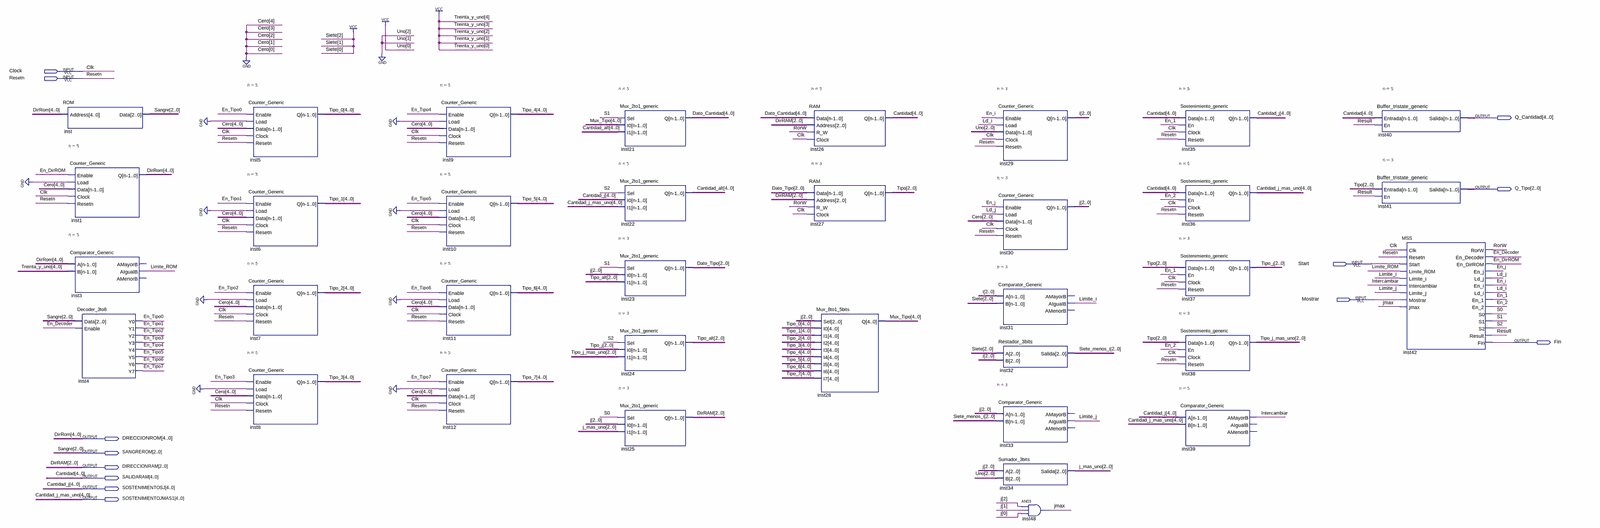
[diagram p0: schematic sheet, whole]
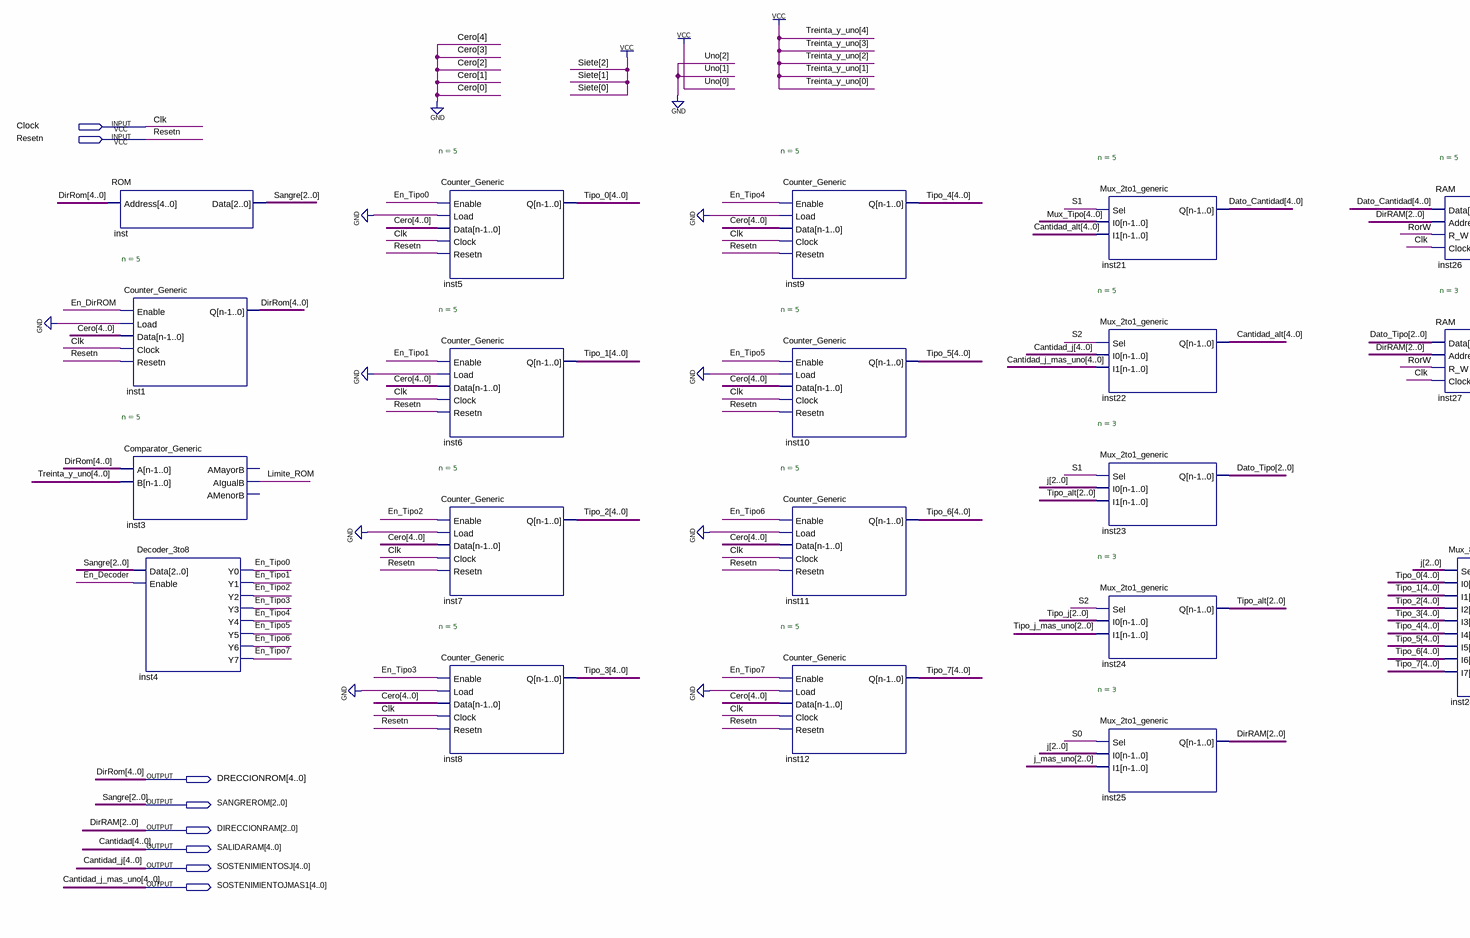
[diagram p1: schematic sheet, left part]
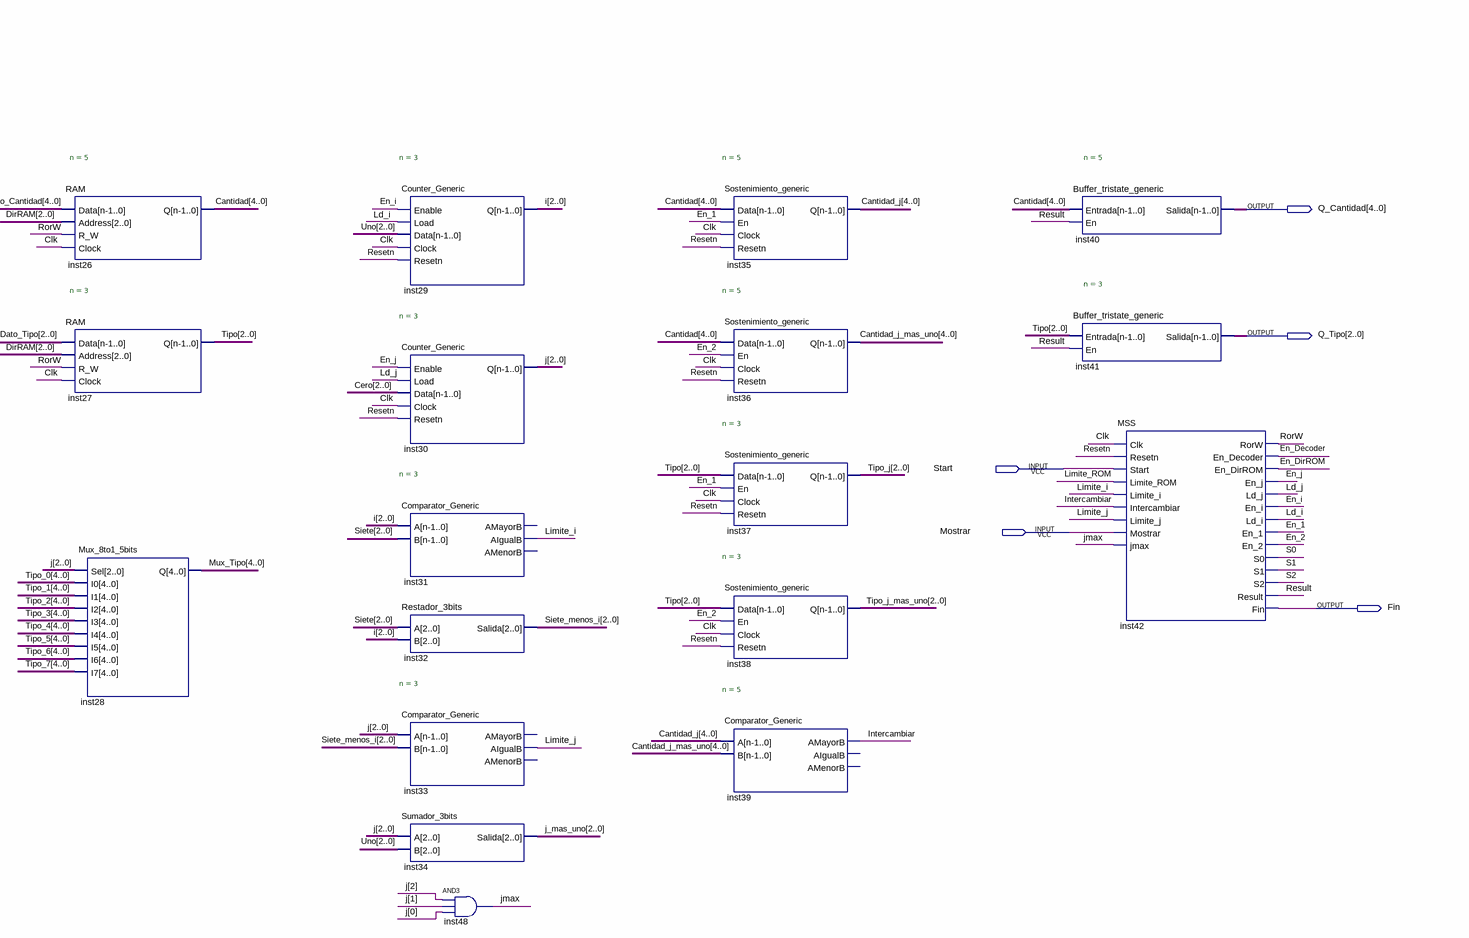
[diagram p2: schematic sheet, right part]
// Quartus schematic Diagram.bdf as structural Verilog: 35 symbols, 13 pins
module Diagram (
  input  Clock,
  input  Resetn,
  input  Start,
  input  Mostrar,
  output [4:0] Q_Cantidad,
  output [2:0] Q_Tipo,
  output Fin,
  output [4:0] DRECCIONROM,
  output [2:0] SANGREROM,
  output [2:0] DIRECCIONRAM,
  output [4:0] SALIDARAM,
  output [4:0] SOSTENIMIENTOSJ,
  output [4:0] SOSTENIMIENTOJMAS1
);

  wire En_1, En_2, En_Decoder, En_DirROM, En_i, En_j, En_Tipo0, En_Tipo1, En_Tipo2, En_Tipo3, En_Tipo4,
       En_Tipo5, En_Tipo6, En_Tipo7, Intercambiar, jmax, Ld_i, Ld_j, Limite_i, Limite_j, Limite_ROM, Result,
       RorW, S0, S1, S2;
  wire [2:0] Dato_Tipo, i, j, j_mas_uno, Siete_menos_i, Tipo, Tipo_alt, Tipo_j, Tipo_j_mas_uno;
  wire [4:0] Cantidad_alt, Dato_Cantidad, Mux_Tipo, Tipo_0, Tipo_1, Tipo_2, Tipo_3, Tipo_4, Tipo_5, Tipo_6,
       Tipo_7;

  ROM inst (.Address(DRECCIONROM), .Data(SANGREROM));
  Counter_Generic #(.n(5)) inst1 (
    .Enable(En_DirROM), .Load(1'b0), .Data({5{1'b0}}), .Clock(Clock), .Resetn(Resetn), .Q(DRECCIONROM));
  Comparator_Generic #(.n(5)) inst3 (.A(DRECCIONROM), .B({5{1'b1}}), .AIgualB(Limite_ROM));  // open: AMayorB, AMenorB
  Decoder_3to8 inst4 (
    .Data(SANGREROM), .Enable(En_Decoder), .Y0(En_Tipo0), .Y1(En_Tipo1), .Y2(En_Tipo2), .Y3(En_Tipo3),
    .Y4(En_Tipo4), .Y5(En_Tipo5), .Y6(En_Tipo6), .Y7(En_Tipo7));
  Counter_Generic #(.n(5)) inst5 (
    .Enable(En_Tipo0), .Load(1'b0), .Data({5{1'b0}}), .Clock(Clock), .Resetn(Resetn), .Q(Tipo_0));
  Counter_Generic #(.n(5)) inst6 (
    .Enable(En_Tipo1), .Load(1'b0), .Data({5{1'b0}}), .Clock(Clock), .Resetn(Resetn), .Q(Tipo_1));
  Counter_Generic #(.n(5)) inst7 (
    .Enable(En_Tipo2), .Load(1'b0), .Data({5{1'b0}}), .Clock(Clock), .Resetn(Resetn), .Q(Tipo_2));
  Counter_Generic #(.n(5)) inst8 (
    .Enable(En_Tipo3), .Load(1'b0), .Data({5{1'b0}}), .Clock(Clock), .Resetn(Resetn), .Q(Tipo_3));
  Counter_Generic #(.n(5)) inst9 (
    .Enable(En_Tipo4), .Load(1'b0), .Data({5{1'b0}}), .Clock(Clock), .Resetn(Resetn), .Q(Tipo_4));
  Counter_Generic #(.n(5)) inst10 (
    .Enable(En_Tipo5), .Load(1'b0), .Data({5{1'b0}}), .Clock(Clock), .Resetn(Resetn), .Q(Tipo_5));
  Counter_Generic #(.n(5)) inst11 (
    .Enable(En_Tipo6), .Load(1'b0), .Data({5{1'b0}}), .Clock(Clock), .Resetn(Resetn), .Q(Tipo_6));
  Counter_Generic #(.n(5)) inst12 (
    .Enable(En_Tipo7), .Load(1'b0), .Data({5{1'b0}}), .Clock(Clock), .Resetn(Resetn), .Q(Tipo_7));
  Mux_2to1_generic #(.n(5)) inst21 (.Sel(S1), .I0(Mux_Tipo), .I1(Cantidad_alt), .Q(Dato_Cantidad));
  Mux_2to1_generic #(.n(5)) inst22 (.Sel(S2), .I0(SOSTENIMIENTOSJ), .I1(SOSTENIMIENTOJMAS1), .Q(Cantidad_alt));
  Mux_2to1_generic #(.n(3)) inst23 (.Sel(S1), .I0(j), .I1(Tipo_alt), .Q(Dato_Tipo));
  Mux_2to1_generic #(.n(3)) inst24 (.Sel(S2), .I0(Tipo_j), .I1(Tipo_j_mas_uno), .Q(Tipo_alt));
  Mux_2to1_generic #(.n(3)) inst25 (.Sel(S0), .I0(j), .I1(j_mas_uno), .Q(DIRECCIONRAM));
  RAM #(.n(5)) inst26 (.Data(Dato_Cantidad), .Address(DIRECCIONRAM), .R_W(RorW), .Clock(Clock), .Q(SALIDARAM));
  RAM #(.n(3)) inst27 (.Data(Dato_Tipo), .Address(DIRECCIONRAM), .R_W(RorW), .Clock(Clock), .Q(Tipo));
  Mux_8to1_5bits inst28 (
    .Sel(j), .I0(Tipo_0), .I1(Tipo_1), .I2(Tipo_2), .I3(Tipo_3), .I4(Tipo_4), .I5(Tipo_5), .I6(Tipo_6),
    .I7(Tipo_7), .Q(Mux_Tipo));
  Counter_Generic #(.n(3)) inst29 (.Enable(En_i), .Load(Ld_i), .Data(3'b001), .Clock(Clock), .Resetn(Resetn), .Q(i));
  Counter_Generic #(.n(3)) inst30 (.Enable(En_j), .Load(Ld_j), .Data(3'b000), .Clock(Clock), .Resetn(Resetn), .Q(j));
  Comparator_Generic #(.n(3)) inst31 (.A(i), .B(3'b111), .AIgualB(Limite_i));  // open: AMayorB, AMenorB
  Restador_3bits inst32 (.A(3'b111), .B(i), .Salida(Siete_menos_i));
  Comparator_Generic #(.n(3)) inst33 (.A(j), .B(Siete_menos_i), .AIgualB(Limite_j));  // open: AMayorB, AMenorB
  Sumador_3bits inst34 (.A(j), .B(3'b001), .Salida(j_mas_uno));
  and inst48 (jmax, j[2], j[1], j[0]);
  Sostenimiento_generic #(.n(5)) inst35 (
    .Data(SALIDARAM), .En(En_1), .Clock(Clock), .Resetn(Resetn), .Q(SOSTENIMIENTOSJ));
  Sostenimiento_generic #(.n(5)) inst36 (
    .Data(SALIDARAM), .En(En_2), .Clock(Clock), .Resetn(Resetn), .Q(SOSTENIMIENTOJMAS1));
  Sostenimiento_generic #(.n(3)) inst37 (.Data(Tipo), .En(En_1), .Clock(Clock), .Resetn(Resetn), .Q(Tipo_j));
  Sostenimiento_generic #(.n(3)) inst38 (.Data(Tipo), .En(En_2), .Clock(Clock), .Resetn(Resetn), .Q(Tipo_j_mas_uno));
  Comparator_Generic #(.n(5)) inst39 (
    .A(SOSTENIMIENTOSJ), .B(SOSTENIMIENTOJMAS1), .AMayorB(Intercambiar));  // open: AIgualB, AMenorB
  Buffer_tristate_generic #(.n(5)) inst40 (.Entrada(SALIDARAM), .En(Result), .Salida(Q_Cantidad));
  Buffer_tristate_generic #(.n(3)) inst41 (.Entrada(Tipo), .En(Result), .Salida(Q_Tipo));
  MSS inst42 (
    .Clk(Clock), .Resetn(Resetn), .Start(Start), .Limite_ROM(Limite_ROM), .Limite_i(Limite_i),
    .Intercambiar(Intercambiar), .Limite_j(Limite_j), .Mostrar(Mostrar), .jmax(jmax), .RorW(RorW),
    .En_Decoder(En_Decoder), .En_DirROM(En_DirROM), .En_j(En_j), .Ld_j(Ld_j), .En_i(En_i), .Ld_i(Ld_i),
    .En_1(En_1), .En_2(En_2), .S0(S0), .S1(S1), .S2(S2), .Result(Result), .Fin(Fin));

  // Other names for the same wires on the sheet: Cantidad[4:0] = SALIDARAM; Cantidad_j[4:0] = SOSTENIMIENTOSJ;
  //   Cantidad_j_mas_uno[4:0] = SOSTENIMIENTOJMAS1; Clk = Clock; DirRAM[2:0] = DIRECCIONRAM;
  //   DirRom[4:0] = DRECCIONROM; Sangre[2:0] = SANGREROM
endmodule
